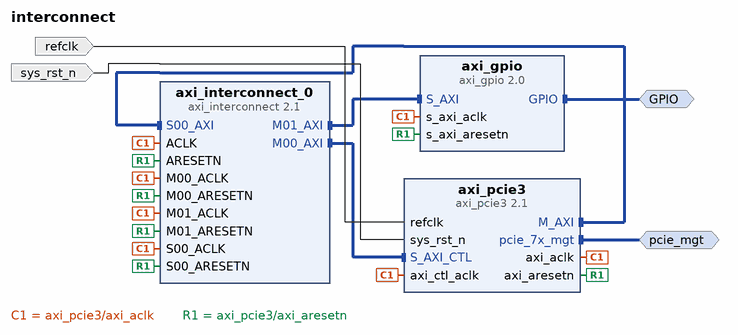
[diagram p0: block diagram of the top level]
# Vivado block design interconnect, Vivado 2016.1
create_bd_design interconnect

create_bd_intf_port -mode Master -vlnv xilinx.com:interface:gpio_rtl:1.0 GPIO
create_bd_intf_port -mode Master -vlnv xilinx.com:interface:pcie_7x_mgt_rtl:1.0 pcie_mgt
create_bd_port -dir I -type clk refclk
set_property -dict [list \
  CONFIG.PHASE 0.0 \
  CONFIG.CLK_DOMAIN design_1_clk_wiz_0_0_clk_out1 \
  CONFIG.ASSOCIATED_RESET sys_rst_n \
] [get_bd_ports refclk]
create_bd_port -dir I -type rst sys_rst_n

create_bd_cell -type ip -vlnv xilinx.com:ip:axi_gpio:2.0 axi_gpio
set_property -dict {CONFIG.C_GPIO_WIDTH 4 CONFIG.C_IS_DUAL 0 CONFIG.C_ALL_INPUTS 0 CONFIG.C_ALL_OUTPUTS 1} [get_bd_cells axi_gpio]
create_bd_cell -type ip -vlnv xilinx.com:ip:axi_interconnect:2.1 axi_interconnect_0
create_bd_cell -type ip -vlnv xilinx.com:ip:axi_pcie3:2.1 axi_pcie3
set_property -dict [list \
  CONFIG.pcie_blk_locn X0Y1 \
  CONFIG.pl_link_cap_max_link_width X8 \
  CONFIG.pl_link_cap_max_link_speed 8.0_GT/s \
  CONFIG.axi_data_width 256_bit \
  CONFIG.axisten_freq 250 \
  CONFIG.en_axi_slave_if false \
  CONFIG.pf0_device_id 7038 \
  CONFIG.pf0_bar0_size 256 \
  CONFIG.pf0_bar1_enabled true \
  CONFIG.pciebar2axibar_1 0x10000000 \
  CONFIG.pf0_interrupt_pin NONE \
  CONFIG.pf0_msi_enabled false \
] [get_bd_cells axi_pcie3]

# ---- connections ----

connect_bd_intf_net [get_bd_intf_pins axi_interconnect_0/S00_AXI] [get_bd_intf_pins axi_pcie3/M_AXI]
connect_bd_intf_net [get_bd_intf_pins axi_interconnect_0/M00_AXI] [get_bd_intf_pins axi_pcie3/S_AXI_CTL]
connect_bd_intf_net [get_bd_intf_pins axi_gpio/S_AXI] [get_bd_intf_pins axi_interconnect_0/M01_AXI]
connect_bd_intf_net [get_bd_intf_ports GPIO] [get_bd_intf_pins axi_gpio/GPIO]
connect_bd_intf_net [get_bd_intf_ports pcie_mgt] [get_bd_intf_pins axi_pcie3/pcie_7x_mgt]
connect_bd_net -net ACLK_1 [get_bd_pins axi_pcie3/axi_aclk] \
  [get_bd_pins axi_pcie3/axi_ctl_aclk] [get_bd_pins axi_gpio/s_axi_aclk] [get_bd_pins axi_interconnect_0/ACLK] \
  [get_bd_pins axi_interconnect_0/M00_ACLK] [get_bd_pins axi_interconnect_0/S00_ACLK] \
  [get_bd_pins axi_interconnect_0/M01_ACLK]
connect_bd_net -net ARESETN_1 [get_bd_pins axi_pcie3/axi_aresetn] \
  [get_bd_pins axi_gpio/s_axi_aresetn] [get_bd_pins axi_interconnect_0/ARESETN] [get_bd_pins axi_interconnect_0/M00_ARESETN] \
  [get_bd_pins axi_interconnect_0/S00_ARESETN] [get_bd_pins axi_interconnect_0/M01_ARESETN]
connect_bd_net [get_bd_ports refclk] [get_bd_pins axi_pcie3/refclk]
connect_bd_net [get_bd_ports sys_rst_n] [get_bd_pins axi_pcie3/sys_rst_n]

# ---- address map ----
assign_bd_address -offset 0x00000000 -range 256M -target_address_space [get_bd_addr_spaces axi_pcie3/M_AXI] [get_bd_addr_segs axi_pcie3/S_AXI_CTL/CTL0]
assign_bd_address -offset 0x10000000 -range 4K -target_address_space [get_bd_addr_spaces axi_pcie3/M_AXI] [get_bd_addr_segs axi_gpio/S_AXI/Reg]

validate_bd_design
save_bd_design
